# EAGLE design untitled (EAGLE 7.6.0)
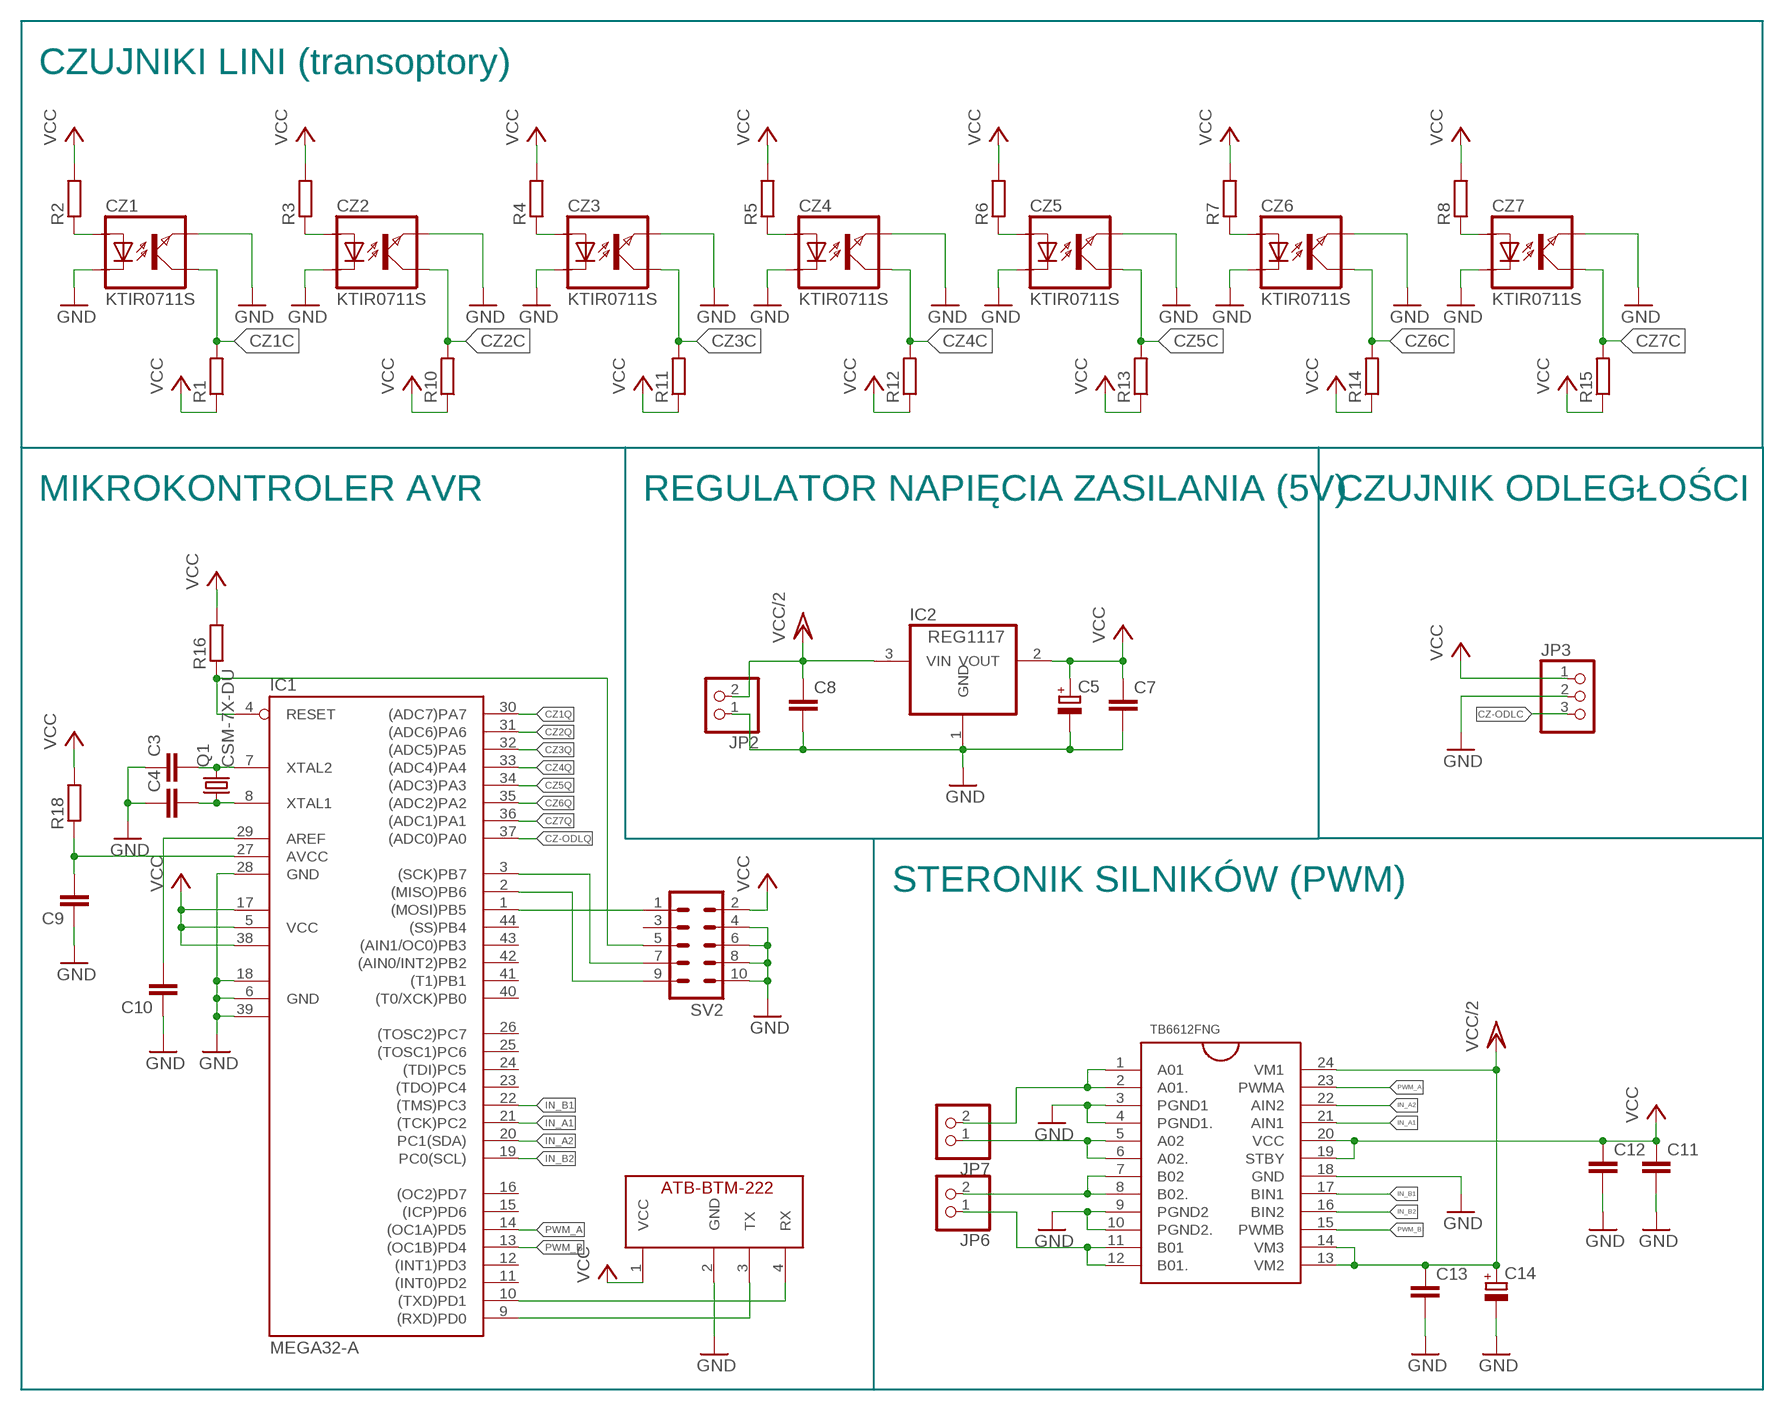
[diagram p0: schematic, sheet 1]

## Parts
C3  C-EUC1206K  [C1206K]
C4  C-EUC1206K  [C1206K]
C5  CPOL-EU175TMP-0810  [175TMP-0810]
C7  C-EUC1206K  [C1206K]
C8  C-EUC1206K  [C1206K]
C9  C-EUC1206K  [C1206K]
C10  C-EUC1206K  [C1206K]
C11  C-EUC1206K  [C1206K]
C12  C-EUC1206K  [C1206K]
C13  C-EUC1206K  [C1206K]
C14  CPOL-EU175TMP-0810  [175TMP-0810]
CZ1  KTIR0711S  [TOP]
CZ2  KTIR0711S  [TOP]
CZ3  KTIR0711S  [TOP]
CZ4  KTIR0711S  [TOP]
CZ5  KTIR0711S  [TOP]
CZ6  KTIR0711S  [TOP]
CZ7  KTIR0711S  [TOP]
IC1  MEGA32-A  [TQFP44]
IC2  REG1117  [SOT223]
JP2  PINHD-1X2  [1X02]
JP3  PINHD-1X3  [1X03]
JP6  PINHD-1X2  [1X02]
JP7  PINHD-1X2  [1X02]
Q1  CSM-7X-DU  [CSM-7X-DU]
R1  R-EU_R0603  [R0603]
R2  R-EU_R0603  [R0603]
R3  R-EU_R0603  [R0603]
R4  R-EU_R0603  [R0603]
R5  R-EU_R0603  [R0603]
R6  R-EU_R0603  [R0603]
R7  R-EU_R0603  [R0603]
R8  R-EU_R0603  [R0603]
R10  R-EU_R0603  [R0603]
R11  R-EU_R0603  [R0603]
R12  R-EU_R0603  [R0603]
R13  R-EU_R0603  [R0603]
R14  R-EU_R0603  [R0603]
R15  R-EU_R0603  [R0603]
R16  R-EU_R0603  [R0603]
R18  R-EU_R0603  [R0603]
SV2  MA05-2  [MA05-2]
U$1  TB6612FNG  [SSOP24]
U$2  ATB-BTM-222  [ATB-BTM-222]

## Nets
CZ1C: CZ1.KOLEKTOR R1.2
CZ1Q: IC1.30((ADC7)PA7)
CZ2C: CZ2.KOLEKTOR R10.2
CZ2Q: IC1.31((ADC6)PA6)
CZ3C: CZ3.KOLEKTOR R11.2
CZ3Q: IC1.32((ADC5)PA5)
CZ4C: CZ4.KOLEKTOR R12.2
CZ4Q: IC1.33((ADC4)PA4)
CZ5C: CZ5.KOLEKTOR R13.2
CZ5Q: IC1.34((ADC3)PA3)
CZ6C: CZ6.KOLEKTOR R14.2
CZ6Q: IC1.35((ADC2)PA2)
CZ7C: CZ7.KOLEKTOR R15.2
CZ7Q: IC1.36((ADC1)PA1)
CZ-ODLC: JP3.3
CZ-ODLQ: IC1.37((ADC0)PA0)
GND: C3.1 C4.1 C5.- C7.2 C8.2 C9.1 C10.1 C11.2 C12.2 C13.2 C14.- CZ1.EMITER CZ1.KATODA CZ2.EMITER CZ2.KATODA CZ3.EMITER CZ3.KATODA CZ4.EMITER CZ4.KATODA CZ5.EMITER CZ5.KATODA CZ6.EMITER CZ6.KATODA CZ7.EMITER CZ7.KATODA IC1.6(GND) IC1.18(GND1) IC1.28(GND) IC1.39(GND2) IC2.1(GND) JP2.1 JP3.2 SV2.4 SV2.6 SV2.8 SV2.10 U$1.3(PGND1) U$1.4(PGND1.) U$1.9(PGND2) U$1.10(PGND2.) U$1.18(GND) U$2.2(GND)
IN_A1: IC1.21((TCK)PC2) U$1.21(AIN1)
IN_A2: IC1.20(PC1(SDA)) U$1.22(AIN2)
IN_B1: IC1.22((TMS)PC3) U$1.17(BIN1)
IN_B2: IC1.19(PC0(SCL)) U$1.16(BIN2)
N$1: IC1.10((TXD)PD1) U$2.4(RX)
N$2: IC1.9((RXD)PD0) U$2.3(TX)
N$4: C9.2 IC1.27(AVCC) R18.1
N$7: C10.2 IC1.29(AREF)
N$10: IC1.1((MOSI)PB5) SV2.1
N$11: IC1.3((SCK)PB7) SV2.7
N$14: IC1.2((MISO)PB6) SV2.9
N$15: IC1.4(RESET) R16.1 SV2.5
N$17: C3.2 IC1.7(XTAL2) Q1.2
N$18: C4.2 IC1.8(XTAL1) Q1.1
N$19: CZ1.ANODA R2.1
N$20: CZ2.ANODA R3.1
N$21: JP6.2 U$1.7(B02) U$1.8(B02.)
N$22: JP6.1 U$1.11(B01) U$1.12(B01.)
N$23: JP7.1 U$1.5(A02) U$1.6(A02.)
N$24: JP7.2 U$1.1(A01) U$1.2(A01.)
N$25: CZ3.ANODA R4.1
N$26: CZ4.ANODA R5.1
N$27: CZ5.ANODA R6.1
N$28: CZ6.ANODA R7.1
N$29: CZ7.ANODA R8.1
PWM_A: IC1.14((OC1A)PD5) U$1.23(PWMA)
PWM_B: IC1.13((OC1B)PD4) U$1.15(PWMB)
VCC: C5.+ C7.1 C11.1 C12.1 IC1.5(VCC) IC1.17(VCC1) IC1.38(VCC2) IC2.2(VOUT) JP3.1 R1.1 R2.2 R3.2 R4.2 R5.2 R6.2 R7.2 R8.2 R10.1 R11.1 R12.1 R13.1 R14.1 R15.1 R16.2 R18.2 SV2.2 U$1.19(STBY) U$1.20(VCC) U$2.1(VCC)
VCC/2: C8.1 C13.1 C14.+ IC2.3(VIN) JP2.2 U$1.13(VM2) U$1.14(VM3) U$1.24(VM1)
Unconnected: IC1.11((INT0)PD2) IC1.12((INT1)PD3) IC1.15((ICP)PD6) IC1.16((OC2)PD7) IC1.23((TDO)PC4) IC1.24((TDI)PC5) IC1.25((TOSC1)PC6) IC1.26((TOSC2)PC7) IC1.40((T0/XCK)PB0) IC1.41((T1)PB1) IC1.42((AIN0/INT2)PB2) IC1.43((AIN1/OC0)PB3) IC1.44((SS)PB4) SV2.3

## Notes on the sheet
- CZUJNIKI LINI (transoptory)
- MIKROKONTROLER AVR | REGULATOR NAPIĘCIA ZASILANIA (5V) | CZUJNIK ODLEGŁOŚCI
- STERONIK SILNIKÓW (PWM)

## Library data of the parts
C3 C4 C7-C13 = resistor:C-EU: CAPACITOR, European symbol
C5 C14 = resistor:CPOL-EU: POLARIZED CAPACITOR, European symbol
CZ1-CZ7 = ktir0711s:KTIR0711S
IC1 = atmel:MEGA32: MICROCONTROLLER 32 Kbytes FLASH 2 Kbytes SRAM 1 Kbytes EEPROM USART 8-channel 10 bit ADC Source: www.atmel.com .. doc2503.pdf; MPN: ATMEGA32-16AU; OC_FARNELL: 9171274; OC_NEWARK: 69K6677
IC2 = burr-brown:REG1117: 800mA and 1A Low Dropout (LDO) Positive Regulator 1.8V, 2.5V, 2.85V, 3.3V, 5V, and Adj; MPN: REG1117; OC_FARNELL: 1097566; OC_NEWARK: 14P6981
JP2 JP6 JP7 = pinhead:PINHD-1X2: PIN HEADER
JP3 = pinhead:PINHD-1X3: PIN HEADER
Q1 = crystal:CSM-7X-DU: SMD CRYSTAL Source: www.ecsxtal.com .. Crystal 3.6864MHz CSM_7X_DU.PDF; OC_FARNELL: unknown; OC_NEWARK: unknown
R1-R8 R10-R16 R18 = resistor:R-EU_: RESISTOR, European symbol
SV2 = con-lstb:MA05-2: PIN HEADER; OC_FARNELL: unknown; OC_NEWARK: unknown
U$1 = TB6612FNG:TB6612FNG
U$2 = _ATNEL:ATB-BTM-222

## Board
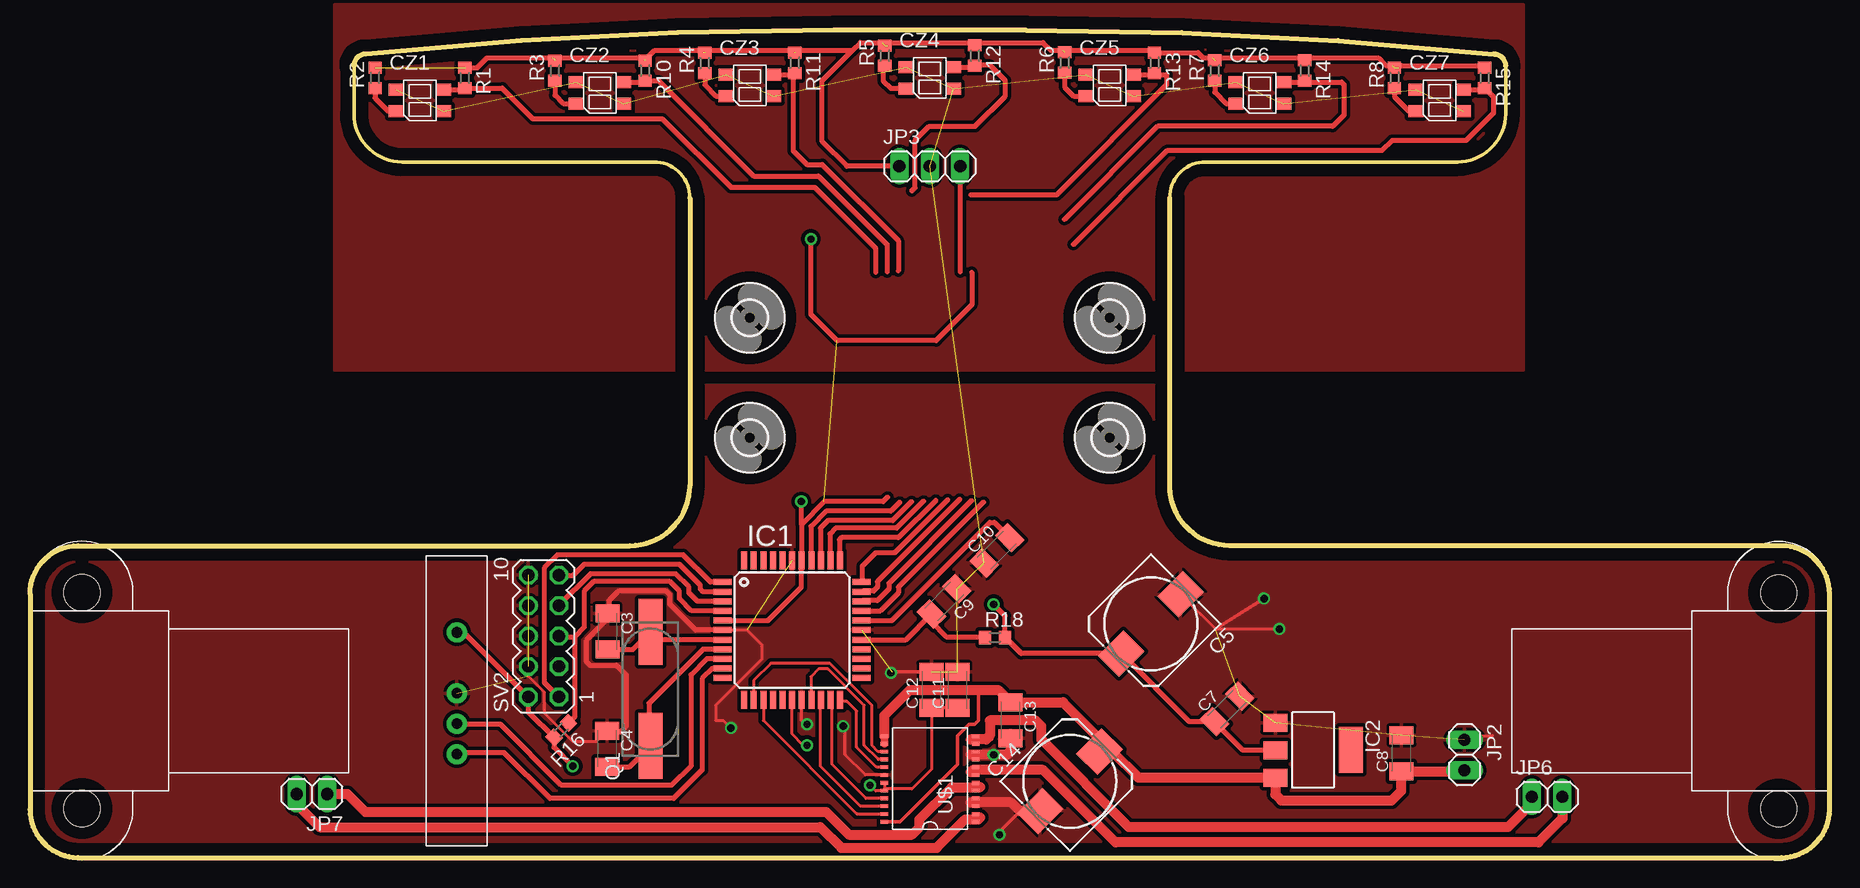
[diagram p1: board, top side]
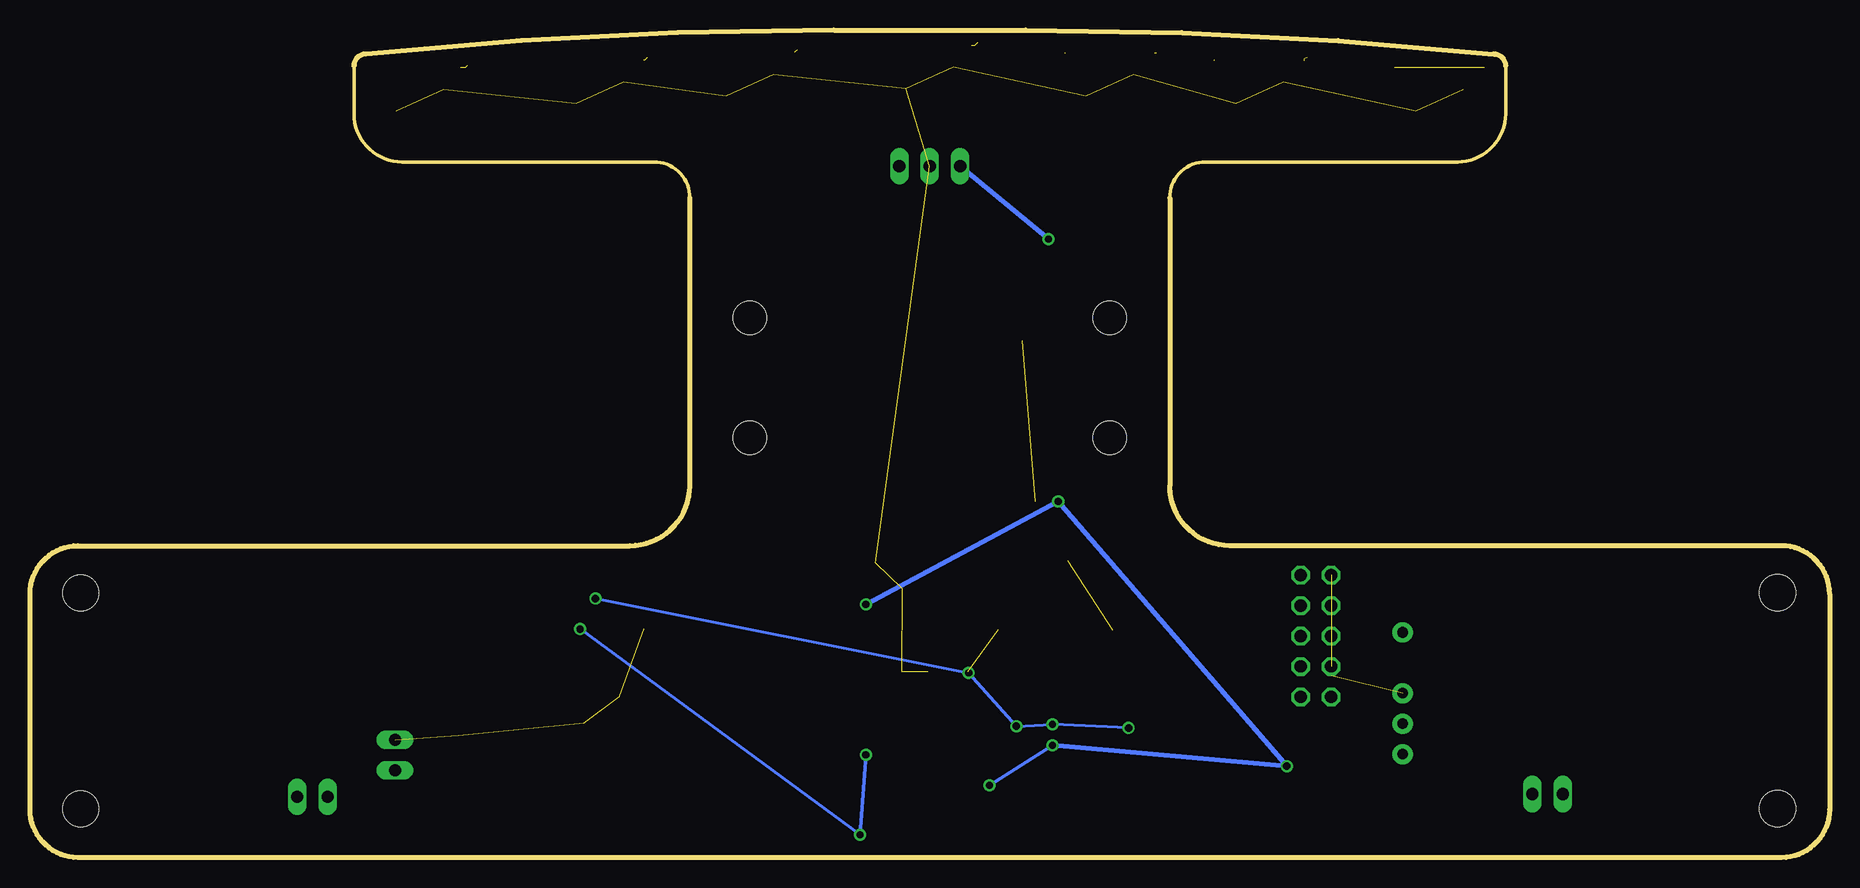
[diagram p2: board, bottom side, seen from below]

Size 150 x 69 mm. Coordinates in mm from the lower left corner, seen from the top.
Outline: 55,55 55,31 arc-90 50,26 4,26 arc90 0,22 0,4 arc90 4,0 146,0 arc90 150,4 150,22 arc90 146,26 100,26 arc-90 95,31 95,55 arc-90 98,58 119,58 arc90 123,62 123,66 arc90 122,67 arc6 83,69 67,69 arc6 28,67 arc90 27,66 27,62 arc90 31,58 52,58 arc-90 55,55
Copper layers (1*16): Top 0.035mm / dielectric 1.5mm / Bottom 0.035mm
Design rules "default": minimum track width 10mil, minimum drill 24mil, track to track 8mil, track to pad 8mil, pad to pad 8mil, via to via 8mil, smd to smd 8mil, copper to edge 40mil, drill to drill 8mil, minimum pad ring 10mil, minimum via ring 8mil, stop-mask expansion 4mil, vias tented up to drill 0mil, thermal gap 10mil

### Footprints (pad centres in the part's own frame; a part is rotated, then mirrored left to right if it is on the bottom)
C1206K = smd 1.5 x 2: 1 -1.5,0; 2 1.5,0
175TMP-0810 = smd 3 x 2.5: + 3.5,0; - -3.5,0
TOP = smd 1.27 x 1: ANODA -1.985,-0.9; EMITER -1.985,0.9; KATODA 1.985,-0.9; KOLEKTOR 1.985,0.91
TQFP44 = smd 1.5 x 0.5: 1 -5.8,4; 2 -5.8,3.2; 3 -5.8,2.4; 4 -5.8,1.6; 5 -5.8,0.8; 6 -5.8,0; 7 -5.8,-0.8; 8 -5.8,-1.6; 9 -5.8,-2.4; 10 -5.8,-3.2; 11 -5.8,-4; 23 5.8,-4; 24 5.8,-3.2; 25 5.8,-2.4; 26 5.8,-1.6; 27 5.8,-0.8; 28 5.8,0; 29 5.8,0.8; 30 5.8,1.6; 31 5.8,2.4; 32 5.8,3.2; 33 5.8,4 | smd 0.5 x 1.5: 12 -4,-5.8; 13 -3.2,-5.8; 14 -2.4,-5.8; 15 -1.6,-5.8; 16 -0.8,-5.8; 17 0,-5.8; 18 0.8,-5.8; 19 1.6,-5.8; 20 2.4,-5.8; 21 3.2,-5.8; 22 4,-5.8; 34 4,5.8; 35 3.2,5.8; 36 2.4,5.8; 37 1.6,5.8; 38 0.8,5.8; 39 0,5.8; 40 -0.8,5.8; 41 -1.6,5.8; 42 -2.4,5.8; 43 -3.2,5.8; 44 -4,5.8
SOT223 = smd 1.499 x 2.007: 1 -2.261,-3.15; 2 0.025,-3.15; 3 2.311,-3.15 | smd 3.81 x 2.007: 4 0,3.15
1X02 = drill 1.016 long: 1 -1.27,0; 2 1.27,0
1X03 = drill 1.016 long: 1 -2.54,0; 2 0,0; 3 2.54,0
CSM-7X-DU = smd 5.5 x 2: 1 -4.75,0; 2 4.75,0
R0603 = smd 1 x 1.1: 1 -0.85,0; 2 0.85,0
MA05-2 = drill 1.016 octagon: 1 -5.08,-1.27; 2 -5.08,1.27; 3 -2.54,-1.27; 4 -2.54,1.27; 5 0,-1.27; 6 0,1.27; 7 2.54,-1.27; 8 2.54,1.27; 9 5.08,-1.27; 10 5.08,1.27
SSOP24 = smd 0.305 x 0.61: 1 -3.567,-3.72; 2 -2.917,-3.72; 3 -2.268,-3.72; 4 -1.617,-3.72; 5 -0.968,-3.72; 6 -0.318,-3.72; 7 0.333,-3.72; 8 0.983,-3.72; 9 1.633,-3.72; 10 2.283,-3.72; 11 2.933,-3.72; 12 3.583,-3.72; 13 3.583,3.9; 14 2.933,3.9; 15 2.283,3.9; 16 1.633,3.9; 17 0.983,3.9; 18 0.333,3.9; 19 -0.318,3.9; 20 -0.968,3.9; 21 -1.617,3.9; 22 -2.268,3.9; 23 -2.917,3.9; 24 -3.567,3.9
ATB-BTM-222 = drill 0.9 pad 1.676: 1 0,0; 2 5.08,0; 3 7.62,0; 4 10.16,0
2,8 = hole 2.8: 0,0
HP_NM = hole 3: -9,-3; 9,-3

### Placement (x,y rotation side)
C3  48.14,18.84 270 top
C4  48.11,9.07 270 top
C5  93.44,19.48 225 top
C7  99.78,12.39 45 top
C8  114.32,8.7 90 top
C9  76.2,21.36 225 top
C10  80.59,25.61 45 top
C11  77.31,13.98 90 top
C12  75.13,13.98 90 top
C13  81.74,11.44 270 top
C14  86.67,6.35 45 top
CZ1  32.5,63.12 0 top
CZ2  47.5,63.76 0 top
CZ3  60,64.37 0 top
CZ4  75,65 0 top
CZ5  90,64.37 0 top
CZ6  102.51,63.75 0 top
CZ7  117.5,63.13 0 top
IC1  63.53,18.96 0 top
IC2  106.95,8.97 270 top
JP2  119.58,8.54 270 top
JP3  75,57.64 0 top
JP6  126.46,5.05 0 top
JP7  23.5,5.29 180 top
Q1  51.72,14.06 90 top
R1  36.25,65 270 top
R2  28.76,65.01 90 top
R3  43.76,65.6 90 top
R4  56.25,66.24 90 top
R5  71.25,66.85 90 top
R6  86.25,66.28 90 top
R7  98.75,65.62 90 top
R8  113.74,65.01 90 top
R10  51.28,65.6 270 top
R11  63.75,66.26 270 top
R12  78.76,66.86 270 top
R13  93.74,66.26 270 top
R14  106.26,65.61 270 top
R15  121.25,65 270 top
R16  44.28,10.62 225 top
R18  80.44,18.34 0 top
SV2  42.81,18.46 90 top
U$1  75.11,6.55 90 top
U$2  35.58,18.78 270 top
U$3  [2,8]  60,35 0 top
U$4  [HP_NM]  142.76,13.06 90 top
U$5  [HP_NM]  7.33,13.08 270 top
U$6  [2,8]  60,45 0 top
U$7  [2,8]  90,45 0 top
U$8  [2,8]  90,35 0 top

### Tracks (layer width: path | path; a pad name or v marks a point on that pad's centre or on a via)
CZ1C
  Top 0.406: CZ1.KOLEKTOR 36.14,64.03 R1.2 39.36,64.15 41.91,61.59 52.7,61.59 58.42,55.88 65.41,55.88 70.48,50.8 70.48,48.81
CZ1Q
  Top 0.406: 79.49,29.64 72.39,22.54 72.39,22.07 70.89,20.57 IC1.30
CZ2C
  Top 0.406: CZ2.KOLEKTOR 51.19,64.67 R10.2 52.41,64.75 60.33,56.83 65.72,56.83 71.44,51.12 71.44,48.84
CZ2Q
  Top 0.406: 78.5,29.76 71.6,22.86 71.6,22.38 70.64,21.43 69.4,21.43 IC1.31
CZ3C
  Top 0.406: CZ3.KOLEKTOR 63.62,65.28 | 63.62,65.28 R11.2 | 63.62,65.28 63.62,58.94 64.77,57.78 66.04,57.78 72.39,51.44 72.39,48.91
CZ3Q
  Top 0.406: 77.48,29.86 70.64,23.02 70.64,22.54 70.33,22.23 69.39,22.23 IC1.32
CZ4C
  Top 0.406: 78.74,66.04 78.61,65.91 CZ4.KOLEKTOR 78.65,65.91 R12.2 78.79,66.05 80.04,66.05 81.3,64.79 81.3,63.48 78.78,60.97 74.94,60.97 73.78,59.8 73.78,55.84 73.5,55.56
CZ4Q
  Top 0.406: 76.49,29.82 72.07,25.4 70.48,25.4 69.37,24.29 69.37,23.01 IC1.33
CZ5C
  Top 0.406: R13.2 93.61,65.28 CZ5.KOLEKTOR 94.74,65.28 94.74,64.42 85.57,55.24 78.42,55.24
CZ5Q
  Top 0.406: 75.5,29.78 72.39,26.67 67.63,26.67 67.47,26.51 67.47,24.83 IC1.34
CZ6C
  Top 0.406: R14.2 106.15,64.66 CZ6.KOLEKTOR 109.33,64.66 109.54,64.45 109.54,61.91 108.58,60.96 93.98,60.96 86.23,53.21
CZ6Q
  Top 0.406: 74.49,29.72 72.23,27.46 67.15,27.46 66.67,26.99 66.67,24.82 IC1.35
CZ7C
  Top 0.406: R15.2 121.14,64.04 CZ7.KOLEKTOR 121.38,64.04 122.01,63.41 122.01,62.1 119.72,59.81 113.55,59.81 112.7,58.96 94.82,58.96 86.98,51.12
CZ7Q
  Top 0.406: 73.5,29.68 71.91,28.1 66.52,28.1 65.88,27.46 65.88,24.81 IC1.36
CZ-ODLC
  Top 0.406: JP3.3 77.54,48.84
CZ-ODLQ
  Top 0.406: 72.5,29.64 71.75,28.89 66.36,28.89 65.09,27.62 65.09,24.81 IC1.37
GND  (via drill 0.6)  (28 unrouted)
  Top 0.254: SV2.4 41.54,15.13 42.86,13.81 42.86,12.06 45.24,9.68 47.22,9.68 C4.1 | U$1.18 69.64,6.88 67.94,8.57 67.94,10.79 v67.79,10.95 | v64.77,11.11 64.61,11.11 64.29,11.43 64.29,13.13 IC1.18 | U$1.4 U$1.3 | IC1.6 59.77,18.96 60.96,17.78 60.96,16.51 57.15,12.7 57.15,11.43 57.78,11.43 v58.42,10.79 | JP2.1 119.92,10.16 121.92,10.16 | C5.- 98.81,19.05 | 98.81,19.05 v104.14,19.05 | 98.81,19.05 v102.87,21.59
  Top 0.305: 78.42,4.6 78.51,4.6 U$1.3 | U$1.10 U$1.9 | 78.42,8.57 78.58,8.57 U$1.10 | C12.2 71.83,15.48 v71.75,15.4 | U$1.10 80.07,8.83 v80.33,8.57 | v80.8,1.91 80.8,2.13 82.55,3.88
  Top 0.406: IC1.6 55.49,18.96 53.34,21.11 53.34,21.91 53.02,22.23 49.05,22.23 48.26,21.43 48.26,20.46 C3.1 48.14,19.88 46.35,18.1 46.35,16.35 46.67,16.03 48.9,16.03 49.69,15.24 49.69,10.95 49.21,10.48 48.21,10.48 C4.1
  Top 0.813: C14.- 82.55,3.88 82.48,3.88 81.76,4.6 78.42,4.6 | C13.2 81.74,8.88 81.44,8.57 v80.33,8.57 78.42,8.57
  Bottom 0.254: v67.79,10.95 v64.77,11.11 v58.42,10.79 | v104.14,19.05 v80.8,1.91 | v102.87,21.59 v71.75,15.4
  Bottom 0.305: v71.75,15.4 v67.79,10.95 | v80.33,8.57 v80.8,1.91
  pour Top (isolate 0.305): -1.27,-1.27 151.13,-1.27 151.13,39.37 -1.27,39.37
GND1
  pour Top (isolate 0.305): 74.93,71.12 25.4,71.12 25.4,40.64 124.46,40.64 124.46,71.12
IN_A1
  Top 0.254: U$1.21 69.68,4.93 66.83,7.78 66.83,13.06 IC1.21
IN_A2
  Top 0.254: U$1.22 69.22,4.28 65.88,7.62 65.88,13.12 IC1.20
IN_B1
  Top 0.254: U$1.17 70.57,7.53 68.9,9.21 68.9,12.22 68.1,13.02 67.68,13.02 IC1.22
IN_B2
  Top 0.254: U$1.16 70.72,8.18 69.53,9.37 69.53,12.7 66.52,15.72 65.72,15.72 65.09,15.08 65.09,13.21 IC1.19
N$1
  Top 0.406: IC1.10 56.88,15.77 56.04,14.92 56.04,7.3 53.66,4.92 43.34,4.92 39.53,8.73 35.69,8.73 U$2.4
N$2
  Top 0.406: IC1.9 56.41,16.57 55.09,15.24 55.09,7.62 53.5,6.03 44.29,6.03 39.21,11.11 35.63,11.11 U$2.3
N$4
  Top 0.406: IC1.27 73.01,18.16 C9.2 75.14,19.63 76.36,18.41 79.51,18.41 R18.1
N$7
  Top 0.406: IC1.29 71.83,19.77 80.01,27.94 80.39,27.94 C10.2
N$10
  Top 0.406: IC1.1 56.73,22.96 54.45,25.24 43.97,25.24 42.86,24.13 42.86,14.6 SV2.1
N$11
  Top 0.406: IC1.3 55.63,21.36 54.93,22.07 54.93,22.54 53.82,23.65 46.73,23.65 SV2.7
N$14
  Top 0.406: IC1.2 56.1,22.16 55.88,22.38 55.88,22.7 54.13,24.45 46.2,24.45 45.24,23.5 44.13,23.5 SV2.9
N$15
  Top 0.406: IC1.4 55.16,20.57 54.13,21.59 54.13,22.23 53.34,23.02 46.99,23.02 46.2,22.23 46.2,19.21 45.4,18.41 | SV2.5 44.13,18.41 45.4,18.41 | 45.4,18.41 45.4,11.75 R16.1
N$17
  Top 0.406: IC1.7 52.36,18.16 Q1.2 50.25,17.34 C3.2
N$18
  Top 0.406: Q1.1 52.07,10.29 52.07,11.43 51.8,11.16 | IC1.8 56.1,17.36 51.59,12.86 51.59,9.43 Q1.1 | C4.2 49.98,7.58 Q1.1
N$19
  Top 0.406: R2.1 28.76,63.32 29.84,62.23 CZ1.ANODA
N$20
  Top 0.406: R3.1 43.76,63.56 44.45,62.87 45.51,62.87 CZ2.ANODA
N$21
  Top 0.305: 78.42,7.14 78.45,7.14 U$1.8 U$1.7
  Top 0.813: JP6.2 127.73,3.27 125.73,1.27 90.49,1.27 84.45,7.3 78.58,7.3 78.42,7.14
N$22
  Top 0.254: 78.42,9.84 78.55,9.84 U$1.12 U$1.11
  Top 0.813: JP6.1 125.19,4.54 123.19,2.54 91.6,2.54 84.3,9.84 84.3,10.95 83.82,11.43 80.01,11.43 80.01,10.16 79.69,9.84 78.42,9.84
N$23
  Top 0.305: U$1.5 U$1.6 79.19,5.87 79.22,5.87
  Top 0.61: JP7.1 25.18,5.29
  Top 0.813: 25.18,5.29 26.45,5.29 27.94,3.81 66.36,3.81 68.26,1.91 73.5,1.91 74.14,2.54 74.14,3.17 76.83,5.87 79.22,5.87
N$24
  Top 0.305: 79.22,3.33 79.13,3.33 U$1.2 U$1.1
  Top 0.813: JP7.2 22.23,4.44 24.13,2.54 65.88,2.54 67.63,0.79 75.56,0.79 77.95,3.17 79.06,3.17 79.22,3.33
N$25
  Top 0.406: R4.1 56.25,64.4 57.15,63.5 57.98,63.5 CZ3.ANODA
N$26
  Top 0.406: R5.1 71.16,66 71.12,66.04 71.12,64.77 71.75,64.14 72.98,64.14 CZ4.ANODA
N$27
  Top 0.406: R6.1 86.25,64.25 87,63.5 87.99,63.5 CZ5.ANODA
N$28
  Top 0.406: R7.1 98.75,63.81 99.69,62.87 100.51,62.87 CZ6.ANODA
N$29
  Top 0.406: R8.1 113.74,63.42 114.94,62.23 CZ7.ANODA
PWM_A
  Top 0.254: IC1.14 61.13,11.42 68.9,3.65 71.2,3.65 U$1.23
PWM_B
  Top 0.254: U$1.15 70.7,8.83 70.17,9.37 70.17,12.7 66.67,16.19 61.75,16.19 60.33,14.76 IC1.13
VCC  (via drill 0.6)  (15 unrouted)
  Top 0.254: C11.1 C12.1 75.13,7.34 73.5,5.71 71.35,5.71 U$1.20 U$1.19 71.22,5.65 71.12,5.56 70.48,5.56 v70.01,6.03 | v64.77,9.37 64.45,9.37 63.5,10.32 63.5,13.13 IC1.17
  Top 0.406: U$2.1 36.15,18.78 SV2.2 41.54,12.16 R16.2 43.68,9.19 v45.24,7.62 | 71.49,30.05 71.12,29.69 66.2,29.69 64.29,27.78 | 64.29,27.78 64.29,24.8 | 64.29,24.8 IC1.38 64.29,24.73 | IC1.5 61.52,19.77 64.29,22.54 64.29,24.73 | IC2.2 101.1,8.95 C7.1 96.64,11.33 C5.+ 82.62,17 | 82.62,17 R18.2 | 64.29,24.73 64.29,24.8 | 64.29,27.78 v64.29,29.69 | 82.62,17 82.62,17.08 81.28,18.41 81.28,20.16 v80.33,21.11 | 114.12,65.86 114.3,66.04 121.06,66.04 R15.1 | 98.85,66.47 99.06,66.67 106.05,66.67 R14.1 106.47,66.47 106.68,66.67 112.39,66.67 113.03,66.04 113.56,66.04 | 86.25,67.2 86.36,67.31 93.54,67.31 R13.1 97.36,67.11 97.79,66.67 98.54,66.67 | 71.51,67.7 71.75,67.94 78.52,67.94 R12.1 78.76,67.93 78.74,67.94 84.45,67.94 85.09,67.31 86.07,67.31 | 43.76,66.62 43.81,66.67 51.06,66.67 R10.1 | 36.24,65.86 R1.1 37.27,65.85 38.1,66.67 43.53,66.67 | 51.28,66.52 52.07,67.31 55.88,67.31 | 55.88,67.31 56.03,67.31 63.5,67.31 | 56.1,67.09 55.88,67.31 | 63.5,67.31 63.55,67.31 68.58,67.31 | 63.7,67.11 63.5,67.31 | 68.58,67.31 69.22,67.94 71.01,67.94 | JP3.1 68.09,57.64 66.04,59.69 66.04,64.77 68.58,67.31 | 78.52,48.77 78.52,46.09 75.53,43.1 67.28,43.1 65.09,45.28 v65.09,51.57
  Bottom 0.254: v70.01,6.03 v64.77,9.37
  Bottom 0.406: v64.77,9.37 v45.24,7.62 v64.29,29.69 v80.33,21.11 | v65.09,51.57 JP3.1
VCC/2
  Top 0.305: U$1.24 72.52,2.98 77.31,7.78 77.31,10.16 78.26,11.11 78.74,11.11 79.06,11.43 79.06,13.81 79.22,13.97
  Top 0.61: U$1.14 U$1.13
  Top 0.813: U$1.13 71.22,11.84 73.34,13.97 79.22,13.97 80.72,13.97 C13.1 86.12,12.94 88.9,10.16 88.9,9.07 C14.+ 90.23,8.83 92.39,6.67 IC2.3 103.8,5.26 104.3,4.76 113.51,4.76 114.3,5.56 114.3,7.18 C8.1 119.5,7.2 JP2.2